# Altium schematic sheet TensorSensor_Driver&DC.SchDoc
size 594 x 420 mm; DocumentNumber: Введите номер платы + Э3; SheetNumber: номер страницы; Format: A2
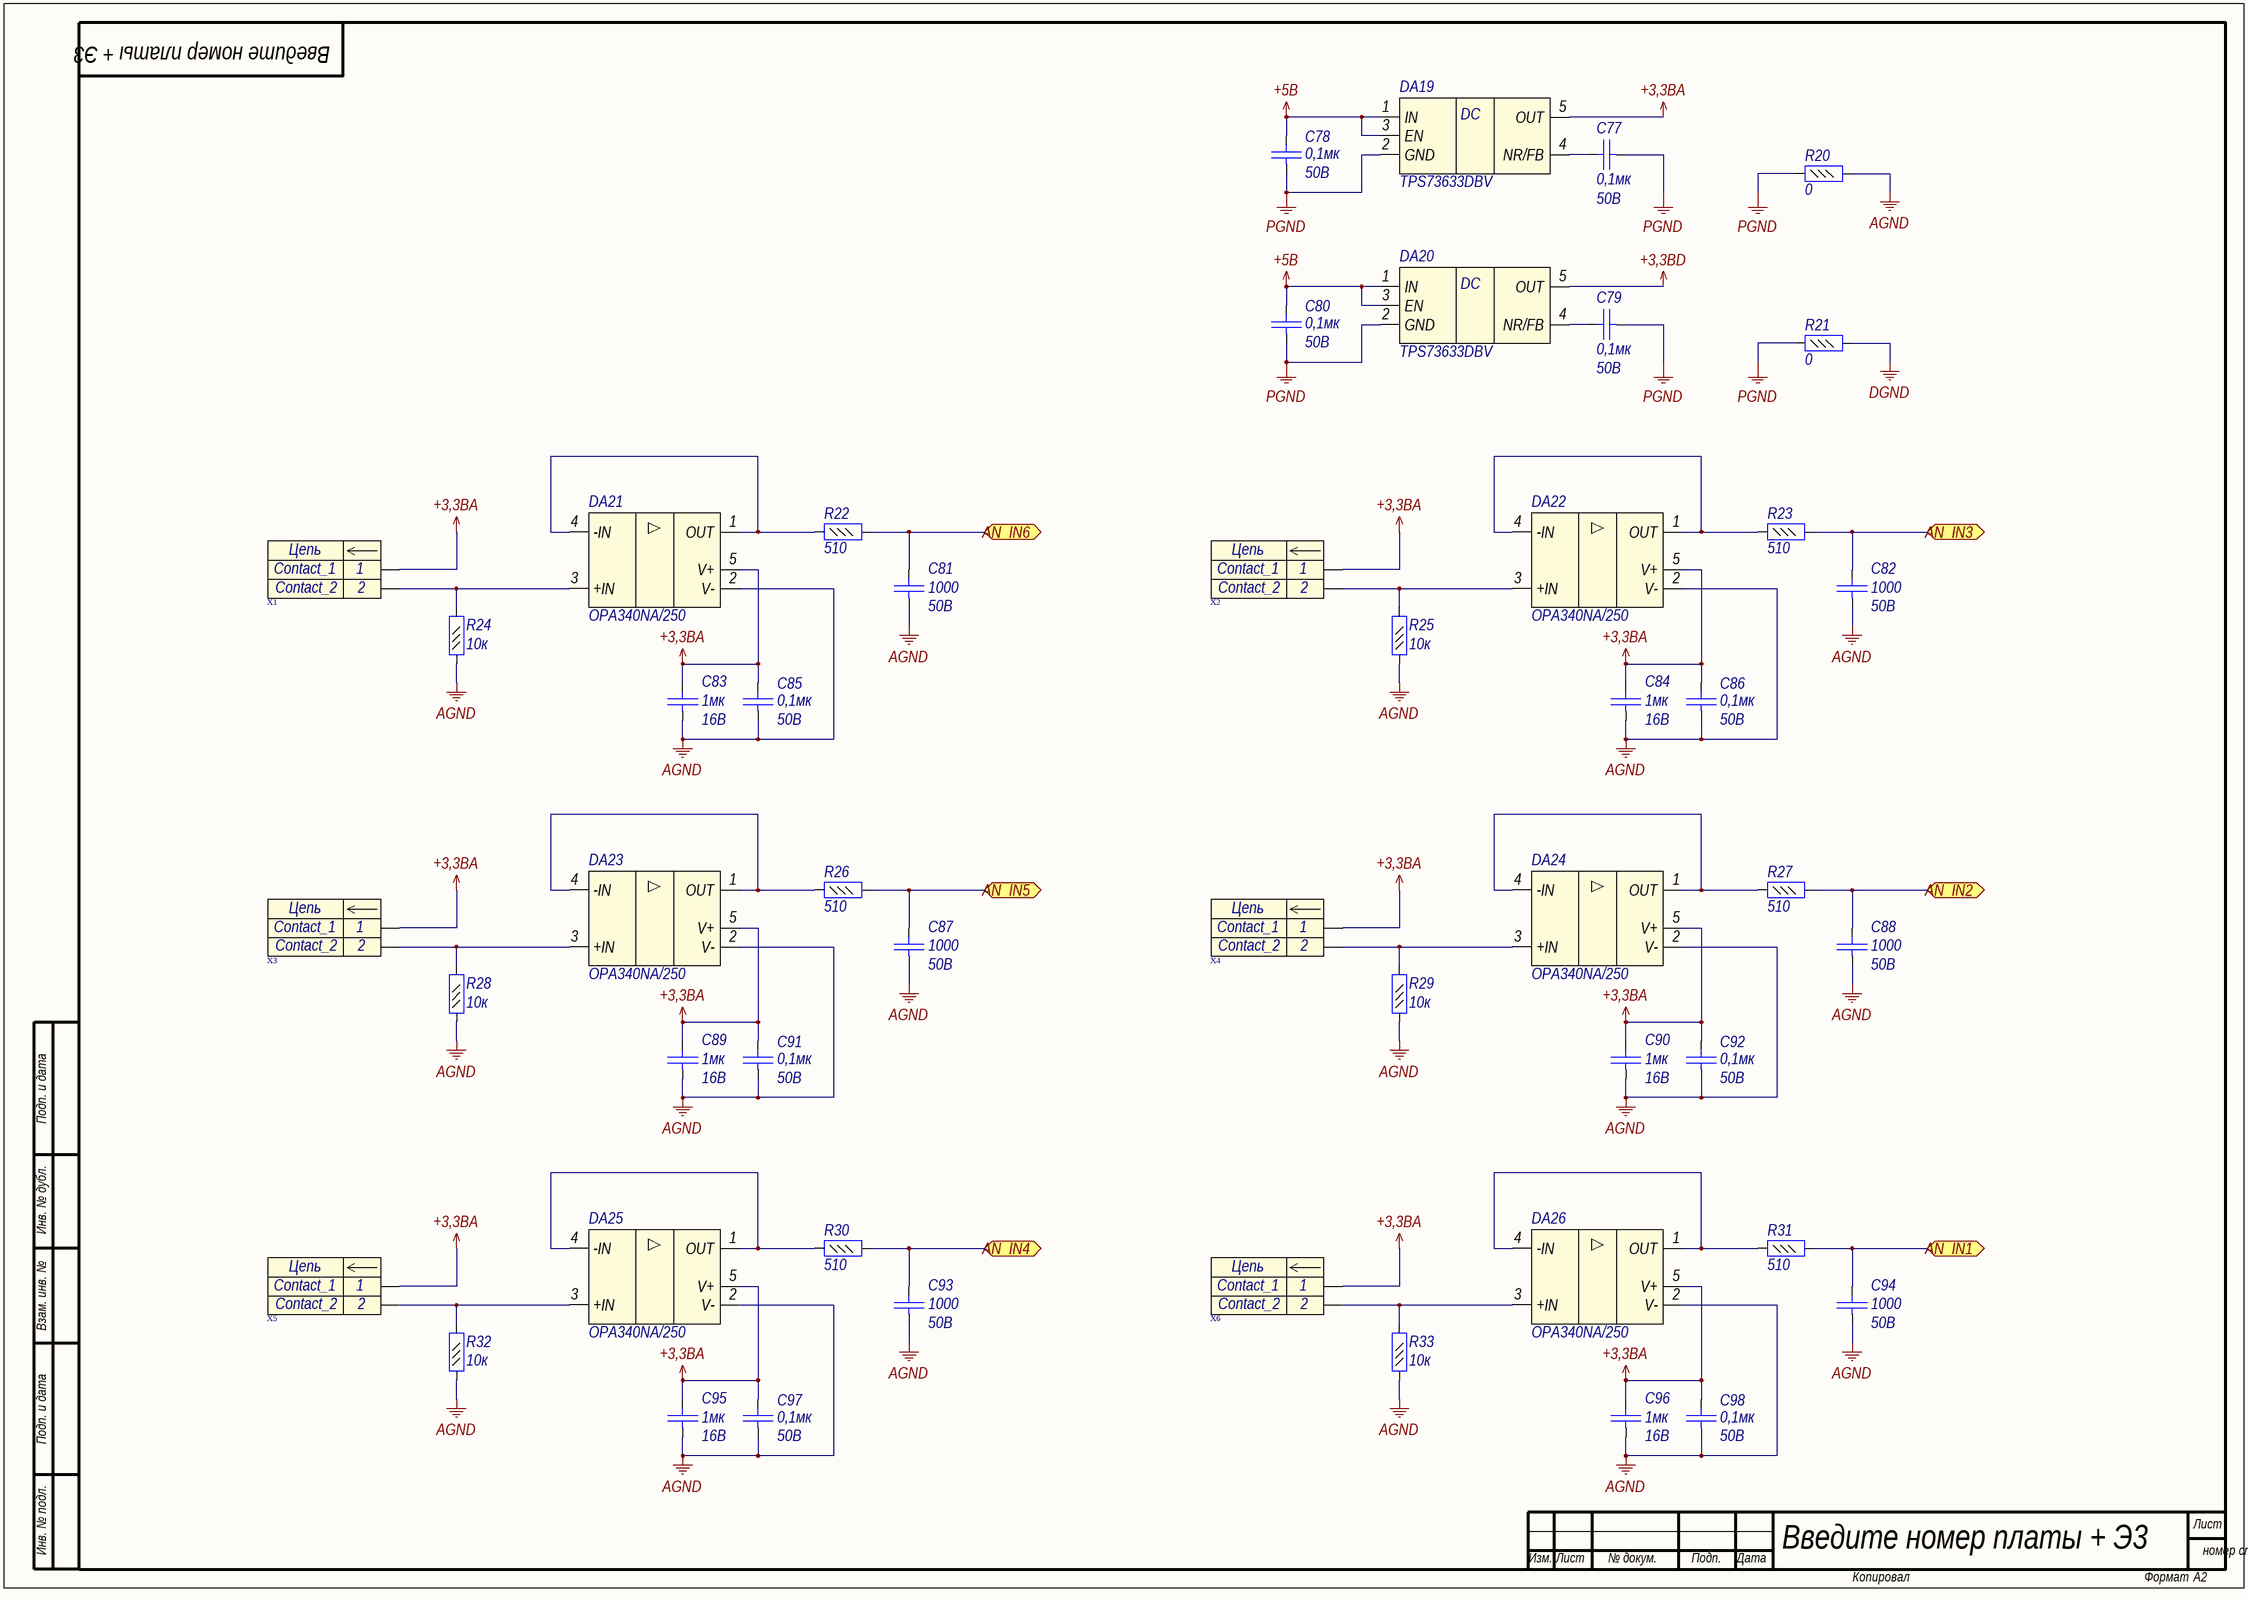
[diagram p0: TensorSensor_Driver&DC.SchDoc]

## Parts
C77  Voltage: 50B  [C0603]  (hidden comment: 0,1мк)
C78  Voltage: 50B  [C0603]  (hidden comment: 0,1мк)
C79  Voltage: 50B  [C0603]  (hidden comment: 0,1мк)
C80  Voltage: 50B  [C0603]  (hidden comment: 0,1мк)
C81  Voltage: 50B  [C0603]  (hidden comment: 1000)
C82  Voltage: 50B  [C0603]  (hidden comment: 1000)
C83  Voltage: 16B  [C0603]  (hidden comment: 1мк)
C84  Voltage: 16B  [C0603]  (hidden comment: 1мк)
C85  Voltage: 50B  [C0603]  (hidden comment: 0,1мк)
C86  Voltage: 50B  [C0603]  (hidden comment: 0,1мк)
C87  Voltage: 50B  [C0603]  (hidden comment: 1000)
C88  Voltage: 50B  [C0603]  (hidden comment: 1000)
C89  Voltage: 16B  [C0603]  (hidden comment: 1мк)
C90  Voltage: 16B  [C0603]  (hidden comment: 1мк)
C91  Voltage: 50B  [C0603]  (hidden comment: 0,1мк)
C92  Voltage: 50B  [C0603]  (hidden comment: 0,1мк)
C93  Voltage: 50B  [C0603]  (hidden comment: 1000)
C94  Voltage: 50B  [C0603]  (hidden comment: 1000)
C95  Voltage: 16B  [C0603]  (hidden comment: 1мк)
C96  Voltage: 16B  [C0603]  (hidden comment: 1мк)
C97  Voltage: 50B  [C0603]  (hidden comment: 0,1мк)
C98  Voltage: 50B  [C0603]  (hidden comment: 0,1мк)
DA19  Part Number: TPS73633DBV  [SOT23-5]  (hidden comment: TPS736DBV)
DA20  Part Number: TPS73633DBV  [SOT23-5]  (hidden comment: TPS736DBV)
DA21  Part Number: OPA340NA/250  [SOT23-5]  (hidden comment: OPA340)
DA22  Part Number: OPA340NA/250  [SOT23-5]  (hidden comment: OPA340)
DA23  Part Number: OPA340NA/250  [SOT23-5]  (hidden comment: OPA340)
DA24  Part Number: OPA340NA/250  [SOT23-5]  (hidden comment: OPA340)
DA25  Part Number: OPA340NA/250  [SOT23-5]  (hidden comment: OPA340)
DA26  Part Number: OPA340NA/250  [SOT23-5]  (hidden comment: OPA340)
R20  value 0  [R0603]  (hidden comment: Resistor_0,062Вт)
R21  value 0  [R0603]  (hidden comment: Resistor_0,062Вт)
R22  value 510  [R0603]  (hidden comment: Resistor_0,062Вт)
R23  value 510  [R0603]  (hidden comment: Resistor_0,062Вт)
R24  value 10к  [R0603]  (hidden comment: Resistor_0,062Вт)
R25  value 10к  [R0603]  (hidden comment: Resistor_0,062Вт)
R26  value 510  [R0603]  (hidden comment: Resistor_0,062Вт)
R27  value 510  [R0603]  (hidden comment: Resistor_0,062Вт)
R28  value 10к  [R0603]  (hidden comment: Resistor_0,062Вт)
R29  value 10к  [R0603]  (hidden comment: Resistor_0,062Вт)
R30  value 510  [R0603]  (hidden comment: Resistor_0,062Вт)
R31  value 510  [R0603]  (hidden comment: Resistor_0,062Вт)
R32  value 10к  [R0603]  (hidden comment: Resistor_0,062Вт)
R33  value 10к  [R0603]  (hidden comment: Resistor_0,062Вт)
X1  (no value)  [CWF-2]
X2  (no value)  [CWF-2]
X3  (no value)  [CWF-2]
X4  (no value)  [CWF-2]
X5  (no value)  [CWF-2]
X6  (no value)  [CWF-2]

## Ports
AN_IN1, AN_IN2, AN_IN3, AN_IN4, AN_IN5, AN_IN6

## Nets
+3,3BA: C83.2 C84.2 C85.2 C86.2 C89.2 C90.2 C91.2 C92.2 C95.2 C96.2 C97.2 C98.2 DA19.5(OUT) DA21.5(V+) DA22.5(V+) DA23.5(V+) DA24.5(V+) DA25.5(V+) DA26.5(V+) X1.1 X2.1 X3.1 X4.1 X5.1 X6.1
+3,3BD: DA20.5(OUT)
+5B: C78.2 C80.2 DA19.1(IN) DA19.3(EN) DA20.1(IN) DA20.3(EN)
AGND: C81.1 C82.1 C83.1 C84.1 C85.1 C86.1 C87.1 C88.1 C89.1 C90.1 C91.1 C92.1 C93.1 C94.1 C95.1 C96.1 C97.1 C98.1 DA21.2(V-) DA22.2(V-) DA23.2(V-) DA24.2(V-) DA25.2(V-) DA26.2(V-) R20.2 R24.1 R25.1 R28.1 R29.1 R32.1 R33.1
DGND: R21.2
PGND: C77.1 C78.1 C79.1 C80.1 DA19.2(GND) DA20.2(GND) R20.1 R21.1
AN_IN1: C94.2 R31.2 ; port AN_IN1
AN_IN2: C88.2 R27.2 ; port AN_IN2
AN_IN3: C82.2 R23.2 ; port AN_IN3
AN_IN4: C93.2 R30.2 ; port AN_IN4
AN_IN5: C87.2 R26.2 ; port AN_IN5
AN_IN6: C81.2 R22.2 ; port AN_IN6
NetC77_2: C77.2 DA19.4(NR/FB)
NetC79_2: C79.2 DA20.4(NR/FB)
NetDA21_1: DA21.1(OUT) DA21.4(-IN) R22.1
NetDA21_3: DA21.3(+IN) R24.2 X1.2
NetDA22_1: DA22.1(OUT) DA22.4(-IN) R23.1
NetDA22_3: DA22.3(+IN) R25.2 X2.2
NetDA23_1: DA23.1(OUT) DA23.4(-IN) R26.1
NetDA23_3: DA23.3(+IN) R28.2 X3.2
NetDA24_1: DA24.1(OUT) DA24.4(-IN) R27.1
NetDA24_3: DA24.3(+IN) R29.2 X4.2
NetDA25_1: DA25.1(OUT) DA25.4(-IN) R30.1
NetDA25_3: DA25.3(+IN) R32.2 X5.2
NetDA26_1: DA26.1(OUT) DA26.4(-IN) R31.1
NetDA26_3: DA26.3(+IN) R33.2 X6.2

## Notes on the sheet
- Подп. и дата
- Инв. № дубл.
- Взам. инв. №
- Инв. № подл.
- Лист
- Изм.
- № докум.
- Подп.
- Дата
- Копировал
- Формат
- (in symbol connect15) Цепь
- (in symbol pwr113) DC

## Library data of the parts
C77-C80 C85 C86 C91 C92 C97 C98 = cap131: Конденсатор; Part Name: Ceramic; Manufacture: Murata; Part Number: GRM188R71H104KA93D; id: cap131; TKE: X7R; Value: 0,1мк
C81 C82 C87 C88 C93 C94 = cap106: Конденсатор; Part Name: Ceramic; Manufacture: Murata; Part Number: GRM1885C1H102J; id: cap106; TKE: NP0; Value: 1000
C83 C84 C89 C90 C95 C96 = cap133: Конденсатор; Part Name: Ceramic; Manufacture: Murata; Part Number: GRM188R71C105KA12D**; id: cap133; TKE: X7R; Value: 1мк
DA19 DA20 = pwr113: 400-mA Low-Dropout Regulator with Reverse Current  Protection; Manufacturer: Texas Instruments; id: pwr113; Input Voltage: 1,7-5,5В; Output Voltage: 3,3B; Dropout Voltage: 75mB; Current: 400mA; Part Name: Low-Dropout Regulator with Reverse Current Protection; Type: Linear
DA21-DA26 = amp23: Operational Amplifiers / MicroAmplifier; Manufacture: Texas Instruments; id: amp23; Rail-to-rail: yes; Supply Voltage: 2,7-5,5B; Supply Current max: 0,75mA; Bandwidth: 5,5MHz; Input Bias Current: 0,2pA; CMRR: 80dB; PSRR: 100dB; Offset voltage: 150uB; Channels: 1; Part Name: Operational Amplifiers MicroAmplifier
R20 R21 = res390: Резистор; Manufacture: Yageo; Part Number: RC0603FR-070RL; id: res390; Accuracy: 0,01; Part Name: Resistor; Power: 0,062Вт
R22 R23 R26 R27 R30 R31 = res456: Резистор; Manufacture: Yageo; Part Number: RC0603FR-07510RL; id: res456; Accuracy: 0,01; Part Name: Resistor; Power: 0,062Вт
R24 R25 R28 R29 R32 R33 = res487: Резистор; Manufacture: Yageo; Part Number: RC0603FR-0710KL; id: res487; Accuracy: 0,01; Part Name: Resistor; Power: 0,062Вт
X1-X6 = connect15: Разъем - 2 конт. вилка; Part Number: DS1069-2MVW6X; Manufacture: Ningbo connfly electronic; Etch: 2,5mm; Contact_1: Contact_1; Contact_2: Contact_2; Part Name: CWF-2; id: connect15